# EAGLE design BabyBeat (EAGLE 9.2.0)
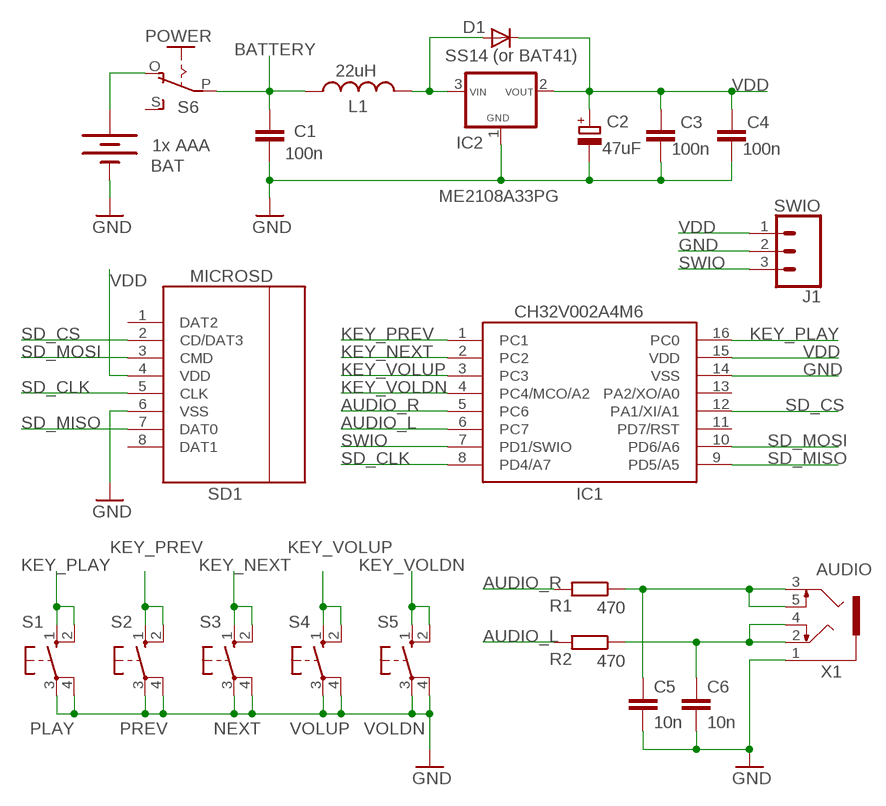
[diagram p0: schematic, sheet 1]

## Parts
BAT  1x AAA  BATTERY-AAA_KIT  [BATTERY-AAA-KIT]
C1  100n  C-EUC1206K  [C1206K]
C2  47uF  CPOL-EU140CLH-0810  [140CLH-0810]
C3  100n  C-EUC1206K  [C1206K]
C4  100n  C-EUC1206K  [C1206K]
C5  10n  C-EUC1206K  [C1206K]
C6  10n  C-EUC1206K  [C1206K]
D1  SS14 (or BAT41)  CGRM4001-G  [SOD-123_MINI-SMA]
IC1  CH32V002A4M6  [SOP16]
IC2  ME2108A33PG  [SOT89-R]
J1  SWIO  CONN_03LONGPADS  [1X03_LONGPADS]
L1  22uH  L-USWE-TPC  [POWER-CHOKE_WE-TPC]
R1  470  R-EU_M1206  [M1206]
R2  470  R-EU_M1206  [M1206]
S1  PLAY  10-XX  [B3F-10XX]
S2  PREV  10-XX  [B3F-10XX]
S3  NEXT  10-XX  [B3F-10XX]
S4  VOLUP  10-XX  [B3F-10XX]
S5  VOLDN  10-XX  [B3F-10XX]
S6  POWER  EG1218S  [EG1218]
SD1  MICROSD  [MICROSD]
X1  AUDIO  1503_09  [1503_09]

## Nets
AUDIO_L: IC1.6(PC7) R2.2
AUDIO_R: IC1.5(PC6) R1.2
BATTERY: C1.1 L1.1 S6.P
GND: BAT.GND@1(-) C1.2 C2.- C3.2 C4.2 C5.2 C6.2 IC1.14(VSS) IC2.1(GND) J1.2 S1.3(P) S1.4(P1) S2.3(P) S2.4(P1) S3.3(P) S3.4(P1) S4.3(P) S4.4(P1) S5.3(P) S5.4(P1) SD1.6(VSS) X1.1
KEY_NEXT: IC1.2(PC2) S3.1(S) S3.2(S1)
KEY_PLAY: IC1.16(PC0) S1.1(S) S1.2(S1)
KEY_PREV: IC1.1(PC1) S2.1(S) S2.2(S1)
KEY_VOLDN: IC1.4(PC4/MCO/A2) S5.1(S) S5.2(S1)
KEY_VOLUP: IC1.3(PC3) S4.1(S) S4.2(S1)
N$2: C5.1 R1.1 X1.3 X1.5
N$3: BAT.PWR@1(+) S6.O
N$4: D1.A IC2.3(IN) L1.2
N$5: C6.1 R2.1 X1.2 X1.4
SD_CLK: IC1.8(PD4/A7) SD1.5(CLK)
SD_CS: IC1.12(PA1/XI/A1) SD1.2(CD/DAT3)
SD_MISO: IC1.9(PD5/A5) SD1.7(DAT0)
SD_MOSI: IC1.10(PD6/A6) SD1.3(CMD)
SWIO: IC1.7(PD1/SWIO) J1.3
VDD: C2.+ C3.1 C4.1 D1.C IC1.15(VDD) IC2.2(VOUT) J1.1 SD1.4(VDD)
Unconnected: IC1.11(PD7/RST) IC1.13(PA2/XO/A0) S6.S SD1.1(DAT2) SD1.8(DAT1)

## Library data of the parts
BAT = SparkFun-Batteries:BATTERY: Battery - Single Cell A variety of battery chemistries, sizes, and footprints. Device List: 20MM_PTH - Coin Cell Battery Holder - 20mm (PTH) <https://www.sparkfun.com/products/783> 6.8MM_PTH - Coin Cell Battery Holder - 6.8MM(SMD) <https://www.digikey.com/product-detail/en/seiko-instruments/MS621FE-FL11E/728-1057-ND/1889208?WT.srch=1&gclid=CNOQ5a6LzdQCFZS2wAodXCkE0g> 12MM_SMD - Coin Cell Battery Holder - 12mm (SMD) <https://www.sparkfun.com/products/10592> 12MM_PTH - Coin Cell Battery Holder - 12mm (PTH) <https://www.sparkfun.com/products/7948> 20MM_SMD - 20mm Coin Cell Battery Holder (SMD) (2 legs) Used on the Big Time Watch Kit <https://www.sparkfun.com/products/11734> 20MM_SMD_4LEGS - Coin Cell Battery Holder - 20mm (SMD) <https://www.sparkfun.com/products/11892> 20MM_SMD_4LEGS_OVERPASTE - Coin Cell Battery Holder - 20mm (SMD) <https://www.sparkfun.com/products/11892> (Over-paste on the legs) 24.5MM_PTH - Coin Cell Battery Holder - 24.5mm (PTH) <https://www.sparkfun.com/products/8863> 9V - 9V Battery Holder - PC Mount Used on the SparkFun SparkPunk Sound Kit <https://www.sparkfun.com/products/11177> and SparkFun SparkPunk Sequencer Kit <https://www.sparkfun.com/products/12707> 18650 - Battery Holder - 18650 (PTH) <https://www.sparkfun.com/products/13113> AA - Battery Holder - 1xAA (PTH) <https://www.sparkfun.com/products/7949> AAA - Battery Holder - 1xAAA (PTH) <https://www.sparkfun.com/products/12718> AA_KIT - Battery Holder - 1xAA (PTH) <https://www.sparkfun.com/products/7949> Special kit package - pads only have exposed copper on one side of the board. AAA_KIT - Battery Holder - 1xAAA (PTH) <https://www.sparkfun.com/products/12718> Special kit package - pads only have exposed copper on one side of the board.; PROD_ID: BATT-08571; SF_SKU: PRT-12718
C1 C3-C6 = rcl:C-EU: CAPACITOR, European symbol; SPICEPREFIX: C
C2 = rcl:CPOL-EU: POLARIZED CAPACITOR, European symbol; SPICEPREFIX: C
D1 = diode:CGRM400*-G: Molded plasitc,JEDEC SOD-123/Mini SMA Source: Comchip CGRM4001-G.pdf
IC1 = CH32V:CH32V002A4M6
IC2 = CH32V:ME2108A33PG
J1 = SparkFun-Connectors:CONN_03: Multi connection point. Often used as Generic Header-pin footprint for 0.1 inch spaced/style header connections On any of the 0.1 inch spaced packages, you can populate with these: Break Away Headers - Straight <https://www.sparkfun.com/products/116> (PRT-00116) Break Away Male Headers - Right Angle <https://www.sparkfun.com/products/553> (PRT-00553) Female Headers <https://www.sparkfun.com/products/115> (PRT-00115) Break Away Headers - Machine Pin <https://www.sparkfun.com/products/117> (PRT-00117) Break Away Female Headers - Swiss Machine Pin <https://www.sparkfun.com/products/743> (PRT-00743) Stackable Header - 3 Pin (Female, 0.1") <https://www.sparkfun.com/products/13875> (PRT-13875) For SCREWTERMINALS and SPRING TERMINALS visit here: Screw Terimnals on SparkFun.com <https://www.sparkfun.com/search/results?term=Screw+Terminals> (5mm/3.5mm/2.54mm spacing) This device is also useful as a general connection point to wire up your design to another part of your project. Our various solder wires solder well into these plated through hole pads. Hook-Up Wire - Assortment (Stranded, 22 AWG) <https://www.sparkfun.com/products/11375> (PRT-11375) Hook-Up Wire - Assortment (Solid Core, 22 AWG) <https://www.sparkfun.com/products/11367> (PRT-11367) View the entire wire category on our website here <https://www.sparkfun.com/categories/141> Special notes: Molex polarized connector foot print use with SKU : PRT-08232 with associated crimp pins and housings.
L1 = rcl:L-US: INDUCTOR, American symbol; SPICEPREFIX: L
R1 R2 = rcl:R-EU_: RESISTOR, European symbol; SPICEPREFIX: R
S1-S5 = switch-omron:10-XX: OMRON SWITCH; MPN: B3F-1000; OC_FARNELL: 176432; OC_NEWARK: 36M3542
S6 = CH32V:EG1218: SLIDING SWITCH 0.1" spacing through hole, vertical SPDT slide switch http://www.ladyada.net/library/pcb/eaglelibrary.html
SD1 = Wuerth_Elektronik_eiCan_Communication_Connectors_v2.2:MICROSD: WR-CRD MICRO SD CARD CONNECTOR HINGE 8PINS
X1 = con-lumberg:1503_09: Jack connectors according to JISC 6560, 3.5 mm Klinkeneinbaukupplung nach JISC 6560, 3,5 mm, 3-polig/ stereo, abgewinkelte Ausführung, mit 2 Öffnern und Lötaugen, für Leiterplatten Rückseitenmontage Source: http://www.lumberg.com/Produkte/PDFs/1503_09.pdf; OC_FARNELL: 1243244; OC_NEWARK: unknown

## Board
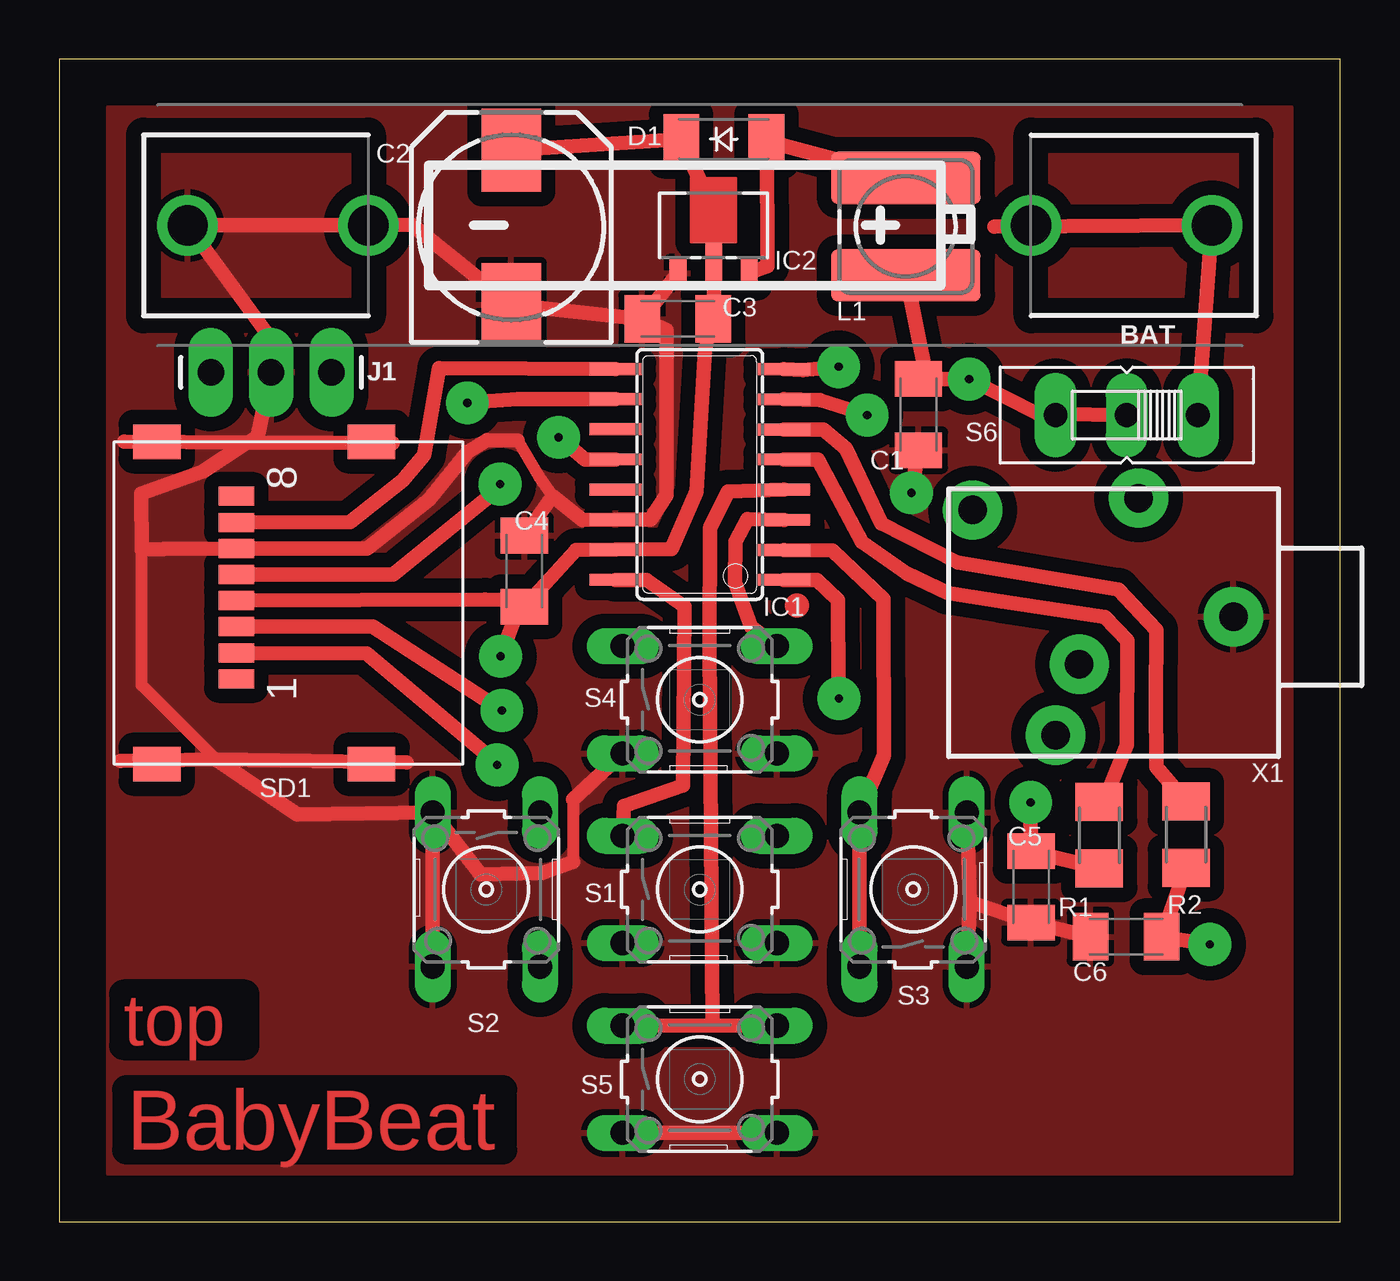
[diagram p1: board, top side]
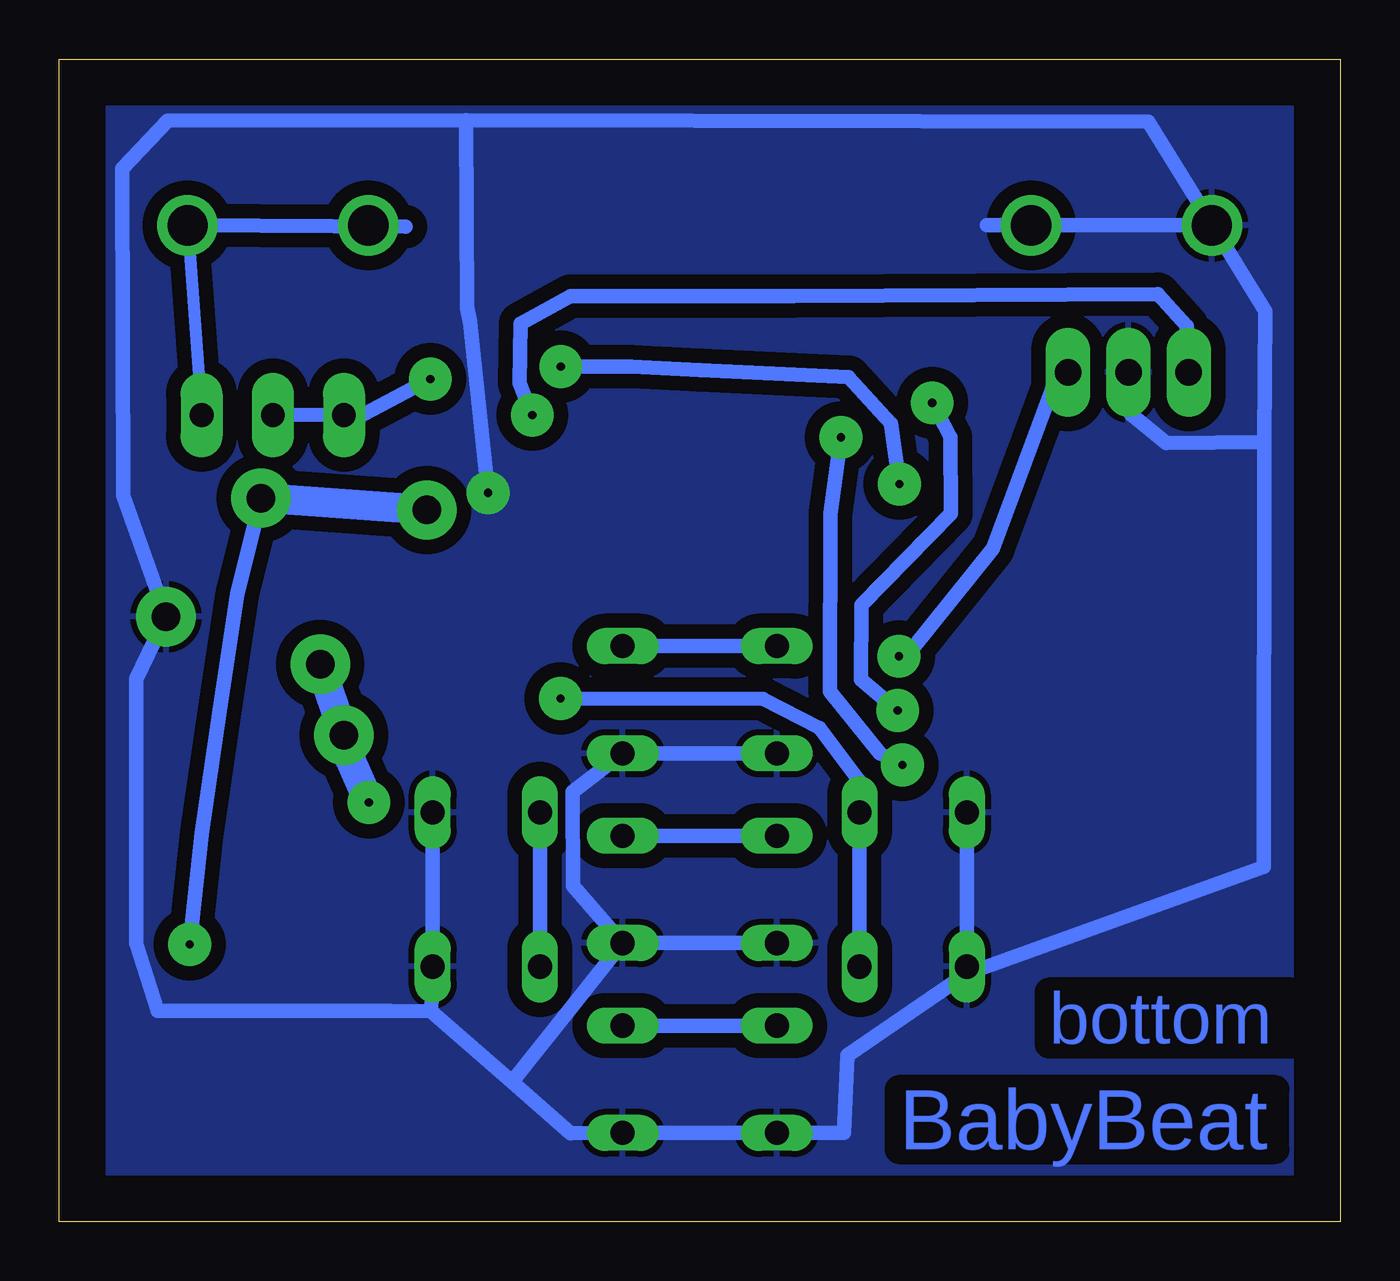
[diagram p2: board, bottom side, seen from below]

Size 54 x 49 mm. Coordinates in mm from the lower left corner, seen from the top.
Outline: 0,0 54,0 54,49 0,49 0,0
Copper layers (1*16): Top 0.035mm / dielectric 1.5mm / Bottom 0.035mm
Design rules "default": minimum track width 6mil, minimum drill 0.35mm, track to track 6mil, track to pad 6mil, pad to pad 6mil, via to via 6mil, smd to smd 6mil, copper to edge 40mil, drill to drill 6mil, minimum pad ring 10mil, minimum via ring 8mil, stop-mask expansion 4mil, vias tented up to drill 0mil, thermal gap 10mil

### Footprints (pad centres in the part's own frame; a part is rotated, then mirrored left to right if it is on the bottom)
BATTERY-AAA-KIT = drill 1.702: GND@1 21.59,0; GND@2 13.97,0; PWR@1 -21.59,0; PWR@2 -13.97,0
C1206K = smd 1.5 x 2: 1 -1.5,0; 2 1.5,0
140CLH-0810 = smd 3.5 x 2.5: + 3.25,0; - -3.25,0
SOD-123_MINI-SMA = smd 1.5 x 2.1: A 1.8,0; C -1.8,0
SOP16 = smd 0.5 x 2.2: 1 -4.445,-3.55; 2 -3.185,-3.55; 3 -1.915,-3.55; 4 -0.645,-3.55; 5 0.635,-3.55; 6 1.895,-3.55; 7 3.165,-3.55; 8 4.435,-3.55; 9 4.445,3.55; 10 3.175,3.55; 11 1.905,3.55; 12 0.635,3.55; 13 -0.635,3.55; 14 -1.905,3.55; 15 -3.175,3.55; 16 -4.445,3.55
SOT89-R = smd 0.7 x 1.1: 1 -1.5,-1.75; 3 1.5,-1.75 | smd 0.7 x 1.8: 2 0,-1.4
1X03_LONGPADS = drill 1.118 pad 1.88 long: 1 0,0; 2 2.54,0; 3 5.08,0
POWER-CHOKE_WE-TPC = smd 6.3 x 2.2: 1 0,2.05; 2 0,-2.05
M1206 = smd 1.6 x 2: 1 -1.4,0; 2 1.4,0
B3F-10XX = drill 1.016 long: 1 -3.251,2.261; 2 3.251,2.261; 3 -3.251,-2.261; 4 3.251,-2.261
EG1218 = drill 1 pad 1.778 long: O -3,0; P 0,0; S 3,0
MICROSD = smd 0.8 x 1.5: 1 2.62,-2.54; 2 1.52,-2.54; 3 0.42,-2.54; 4 -0.68,-2.54; 5 -1.78,-2.54; 6 -2.88,-2.54; 7 -3.98,-2.54; 8 -5.08,-2.54 | smd 1.45 x 2: Z1 -7.38,3.16; Z2 6.22,3.16; Z3 -7.38,-5.89; Z4 6.22,-5.89
1503_09 = drill 1.2 pad 2.5: 1 0,-2; 2 -5,-6; 3 5,-9.5; 4 -4.5,-13; 5 2,-8.5

### Placement (x,y rotation side)
BAT  27,42 180 top
C1  36.22,34.02 270 top
C2  19.05,41.91 90 top
C3  26.07,38.05 180 top
C4  19.6,27.42 90 top
C5  40.97,14.11 270 top
C6  44.97,12.01 180 top
D1  28.01,45.63 0 top
IC1  27,31.5 90 top
IC2  27.58,41.74 0 top
J1  11.47,35.81 180 top
L1  35.69,41.95 180 top
R1  43.84,16.29 90 top
R2  47.5,16.31 90 top
S1  27,14 0 top
S2  18,14 270 top
S3  36,14 90 top
S4  27,22 0 top
S5  27,6 0 top
S6  45,34 180 top
SD1  10,25.5 270 top
X1  51.5,25.5 270 top

### Tracks (layer width: path | path; a pad name or v marks a point on that pad's centre or on a via)
AUDIO_L
  Top 0.61: IC1.6 32.23,33.39 33.17,32.6 34.67,29.42 37.88,27.78 44.65,26.64 46.24,24.94 46.23,22.02 46.25,19.16 R2.2
AUDIO_R
  Top 0.508: 44.26,18.27 R1.2
  Top 0.61: IC1.5 31.99,32.12 33.83,28.65 35.74,27.32 37.47,26.5 39.74,26.15 44.09,25.5 45.02,24.5 45,20.1 44.26,18.27
BATTERY  (via drill 0.35 pad 1.8)
  Top 0.508: 36.58,35.52 C1.1
  Top 0.61: L1.1 36.58,35.52 v38.36,35.52 41.27,34.05 42,34.05 S6.P
  Bottom 0.61: S6.P 41.2,34.02 v38.36,35.52
GND  (via drill 0.35 pad 1.8)
  Top 0.508: 6.62,19.47 3.47,22.61 3.47,28.33 | 21.65,17.79 21.66,15.17 | 7.9,32.85 8.37,33.2 | 20.8,30.6 20.21,31.43 19.31,32.92
  Top 0.61: S2.3 10.02,17.16 6.62,19.47 | IC2.1 C3.2 | C3.2 C2.- 14.85,42.03 13.77,42 BAT.GND@1 8.7,37.52 J1.2 8.37,33.2 | S2.3 17.77,14.64 20.38,14.69 21.66,15.17 | S4.3 21.65,17.79 | 7.9,32.85 6.04,31.61 3.46,30.7 3.47,28.33 4.4,28.36 SD1.6 12.98,28.37 15.59,30.44 17.21,32.45 18.03,32.95 19.31,32.92 | 38.38,13.48 C5.2 C6.2 | 38.38,13.48 S3.3 | 38.38,13.48 S3.4 | C3.2 25.6,37.59 25.61,30.63 24.92,29.61 IC1.14 22.05,29.58 20.8,30.6 C4.2 | 6.62,19.47 14.65,19.36 | 6.62,19.47 2.6,19.43 | 7.9,32.85 14.05,32.81 | 7.9,32.85 2.74,32.88 | C1.2 v35.92,30.73 | S2.3 S2.4 | S5.3 S5.4
  Bottom 0.508: 15.76,10.44 S2.4 | 5.41,42.04 BAT.GND@1
  Bottom 0.61: S2.4 S2.3 | 34.92,5.9 32.44,3.73 S5.4 S5.3 20.92,3.73 20.78,7.01 15.76,10.44 3.23,14.95 3.2,32.86 | 34.92,5.9 38.32,8.87 | 38.32,8.87 S3.3 S3.4 | 38.32,8.87 40.05,8.89 49.86,8.88 50.76,11.73 50.76,22.87 X1.1 51.3,30.6 51.35,44.38 49.43,46.41 36.84,46.43 | S1.4 S1.3 | S4.3 S4.4 32.37,18.12 32.34,14.15 S1.4 | 36.84,46.43 8.08,46.37 5.41,42.04 3.16,38.39 3.2,32.86 | J1.2 8.83,34.05 7.33,32.83 3.2,32.86 | S1.4 32.43,9.02 34.92,5.9 | v35.92,30.73 36.69,37.91 36.8,38.54 36.84,46.43 | BAT.GND@1 14.89,42.01
  pour Bottom (isolate 0.61): 2,2 2,47 52,47 52,2
  pour Top (isolate 0.61): 2,2 52,2 52,47 2,47
KEY_NEXT
  Top 0.61: IC1.2 32.61,28.3 34.75,26.25 34.76,19.65 S3.2 S3.1
  Bottom 0.61: S3.2 S3.1
KEY_PLAY
  Top 0.61: IC1.16 24.75,27.04 26.36,25.93 26.3,18.38 23.81,17.52 S1.1
  Bottom 0.61: S1.1 S1.2
KEY_PREV  (via drill 0.35 pad 1.8)
  Top 0.61: IC1.1 31.93,27.05 32.83,26.2 32.85,22.66 v32.87,22.05
  Bottom 0.61: S2.2 S2.1 20.3,18.6 21.95,20.81 24.34,22.03 v32.87,22.05
KEY_VOLDN
  Top 0.61: IC1.4 28.19,30.77 27.44,29.24 27.41,24.31 27.54,8.26 | 27.54,8.26 S5.1 | 27.54,8.26 S5.2
  Bottom 0.61: S5.1 S5.2
KEY_VOLUP
  Top 0.61: IC1.3 29.01,29.62 28.5,28.67 28.5,26.95 29.16,25.09 S4.2
  Bottom 0.61: S4.1 S4.2
N$2  (via drill 0.35 pad 1.8)
  Top 0.61: R1.1 C5.1 v40.95,17.67
  Bottom 0.61: 41.97,20.3 X1.3
  Bottom 1.27: X1.3 X1.5 | v40.95,17.67 41.67,19.36 41.97,20.3
N$3
  Top 0.61: 39.43,41.95 BAT.PWR@1 S6.O
  Bottom 0.508: BAT.PWR@1 S6.O
  Bottom 0.61: BAT.PWR@1 39.4,41.95
N$4
  Top 0.508: 29.84,45.54 D1.A
  Top 0.61: L1.2 29.84,45.54 29.86,40.27 IC2.3
N$5  (via drill 0.35 pad 1.8)
  Top 0.61: v48.5,11.68 C6.1 R2.1
  Bottom 0.61: X1.2 46.51,26.43 47.25,21.54 47.99,16.35 v48.5,11.68
  Bottom 1.27: X1.4 X1.2
SD_CLK  (via drill 0.35 pad 1.8)
  Top 0.61: SD1.5 14.08,27.27 18.35,30.75 v18.58,31.1 | v32.86,36.04 31.35,35.9 IC1.8
  Bottom 0.61: v18.58,31.1 18.93,33.64 20.72,35.61 26.99,35.9 29.88,36.05 v32.86,36.04
SD_CS  (via drill 0.35 pad 1.8)
  Top 0.61: SD1.2 12.95,23.95 17.9,19.77 v18.45,19.25 | v21.05,33.07 22.17,32.13 IC1.12
  Bottom 0.61: v18.45,19.25 19.41,19.74 21.51,22.35 21.49,29.85 v21.05,33.07
SD_MISO
  Top 0.61: IC1.9 16,35.97 15.38,32.32 14.48,31.25 12.27,29.48 SD1.7
SD_MOSI  (via drill 0.35 pad 1.8)
  Top 0.61: SD1.3 13.2,25.09 v18.66,21.55 | v17.2,34.52 19.32,34.67 IC1.10
  Bottom 0.61: v18.66,21.55 20.21,22.84 20.19,25.98 16.42,29.86 16.43,33.07 v17.2,34.52
SWIO  (via drill 0.35 pad 1.8)
  Top 0.61: IC1.7 32.07,34.63 v34.06,34
  Bottom 0.61: v34.06,34 34.59,35.35 34.56,37.86 32.44,39.02 23.04,39.01 7.68,39.09 6.47,37.76 J1.3
VDD  (via drill 0.35 pad 1.8)
  Top 0.508: 27.52,42.77 IC2.2 | 27.59,38.78 C3.1 | C4.1 19.48,26.19
  Top 0.61: C2.+ D1.C 27.52,42.77 | IC2.2 27.59,38.78 | C3.1 27.22,36.77 26.87,30.78 25.81,28.36 IC1.15 21.79,28.31 C4.1 | SD1.4 17.95,26.22 19.48,26.19 v18.6,23.84
  Bottom 0.508: 18.1,24.07 v18.6,23.84
  Bottom 0.61: J1.1 11.9,35.75 14.65,28.37 18.1,24.07
(copper drawn outside any net)
  shapes: Top circle x1

### Text on the board
Top: top | BabyBeat
Bottom: bottom | BabyBeat
Document: VCC